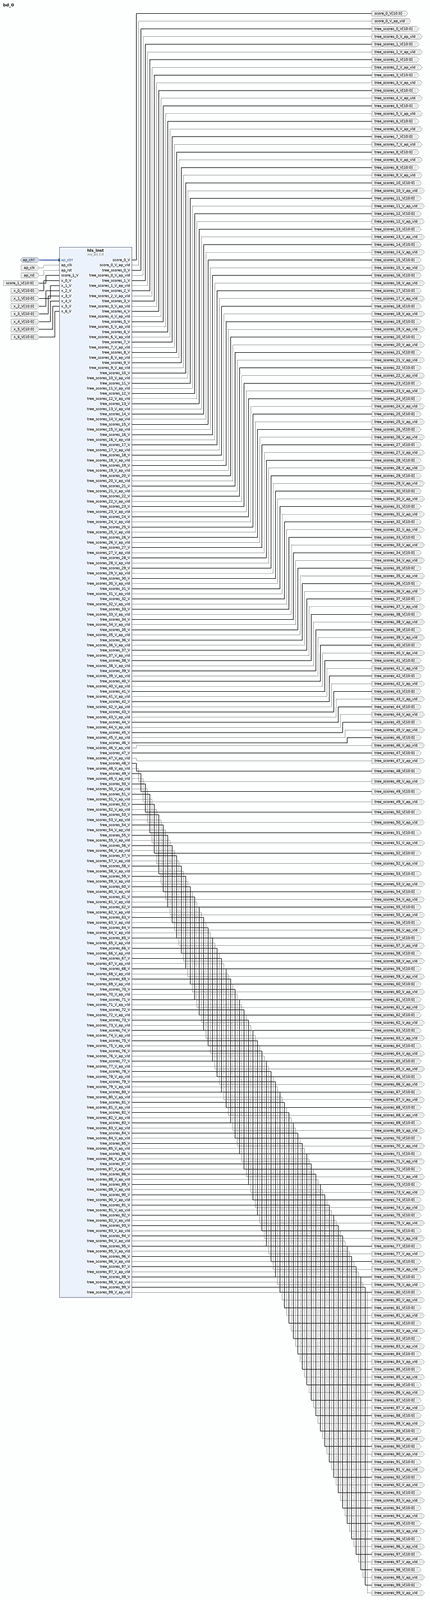
[diagram p0: block diagram of the top level, whole]
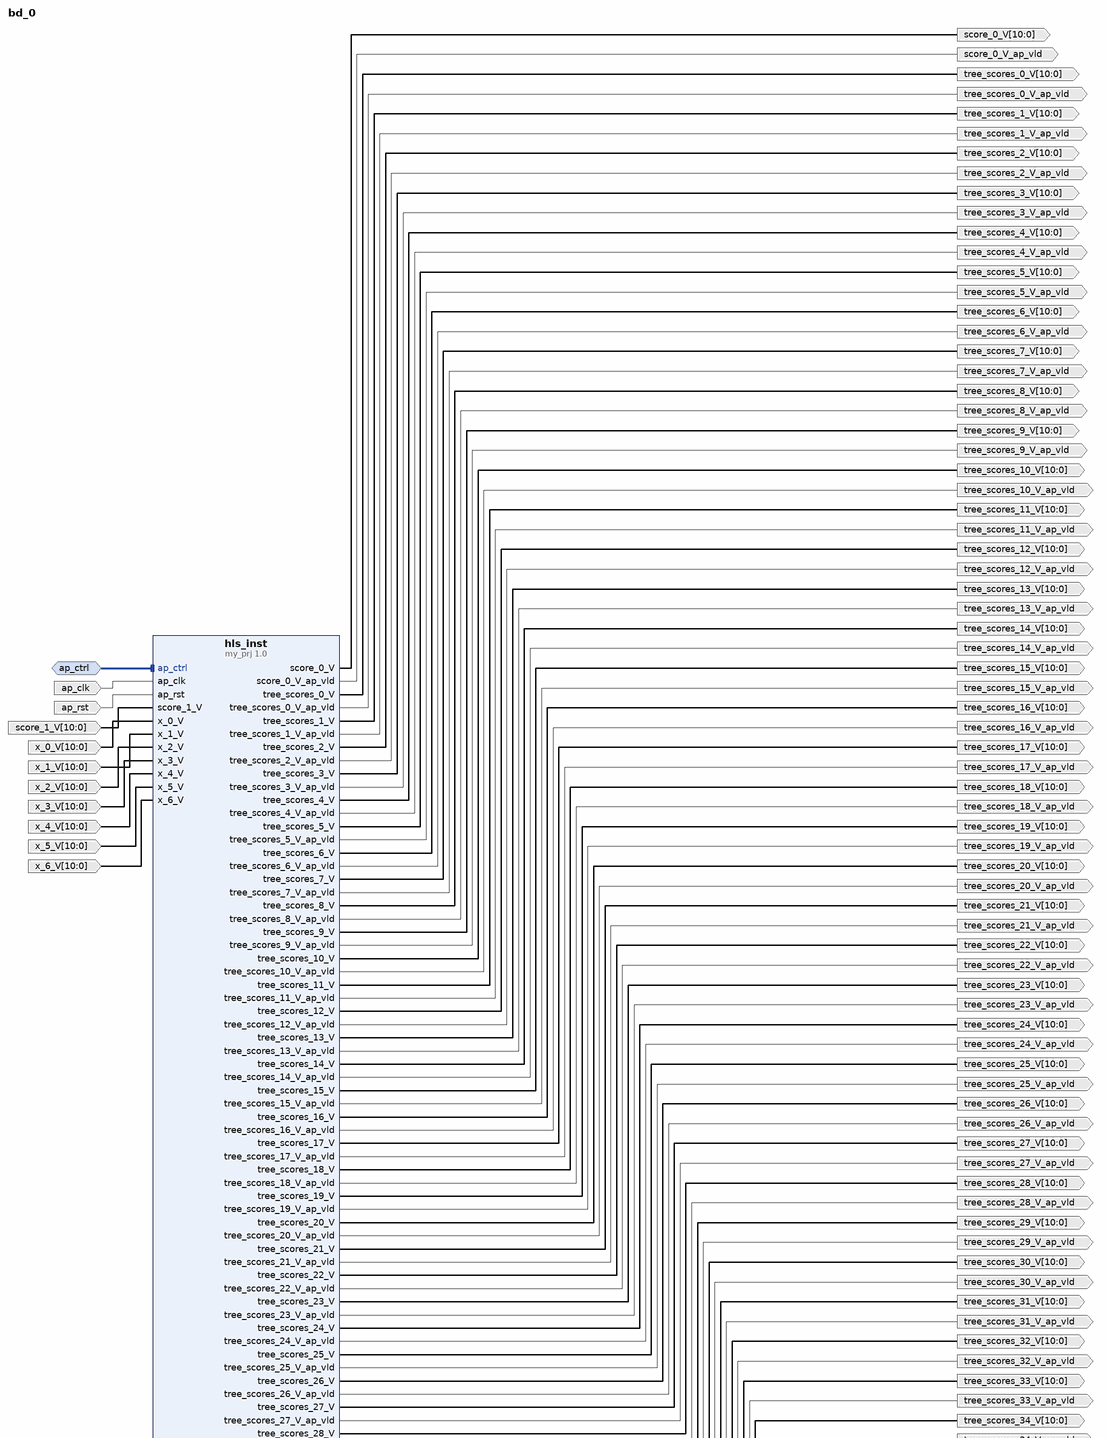
[diagram p1: block diagram of the top level, upper part]
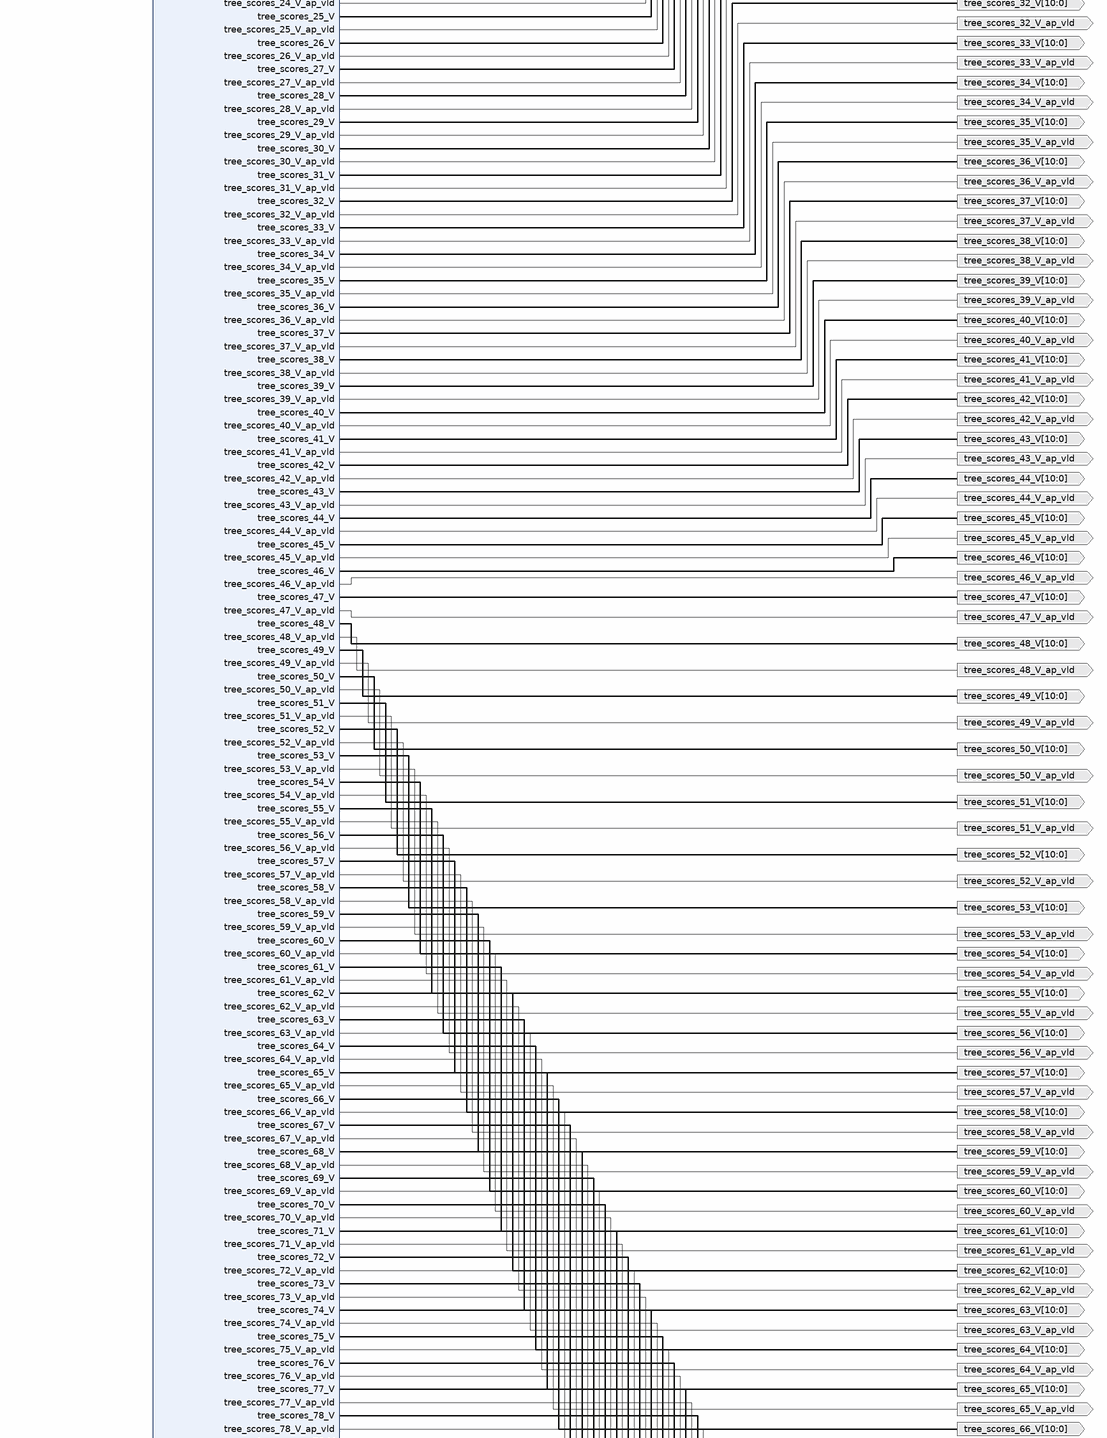
[diagram p2: block diagram of the top level, middle part]
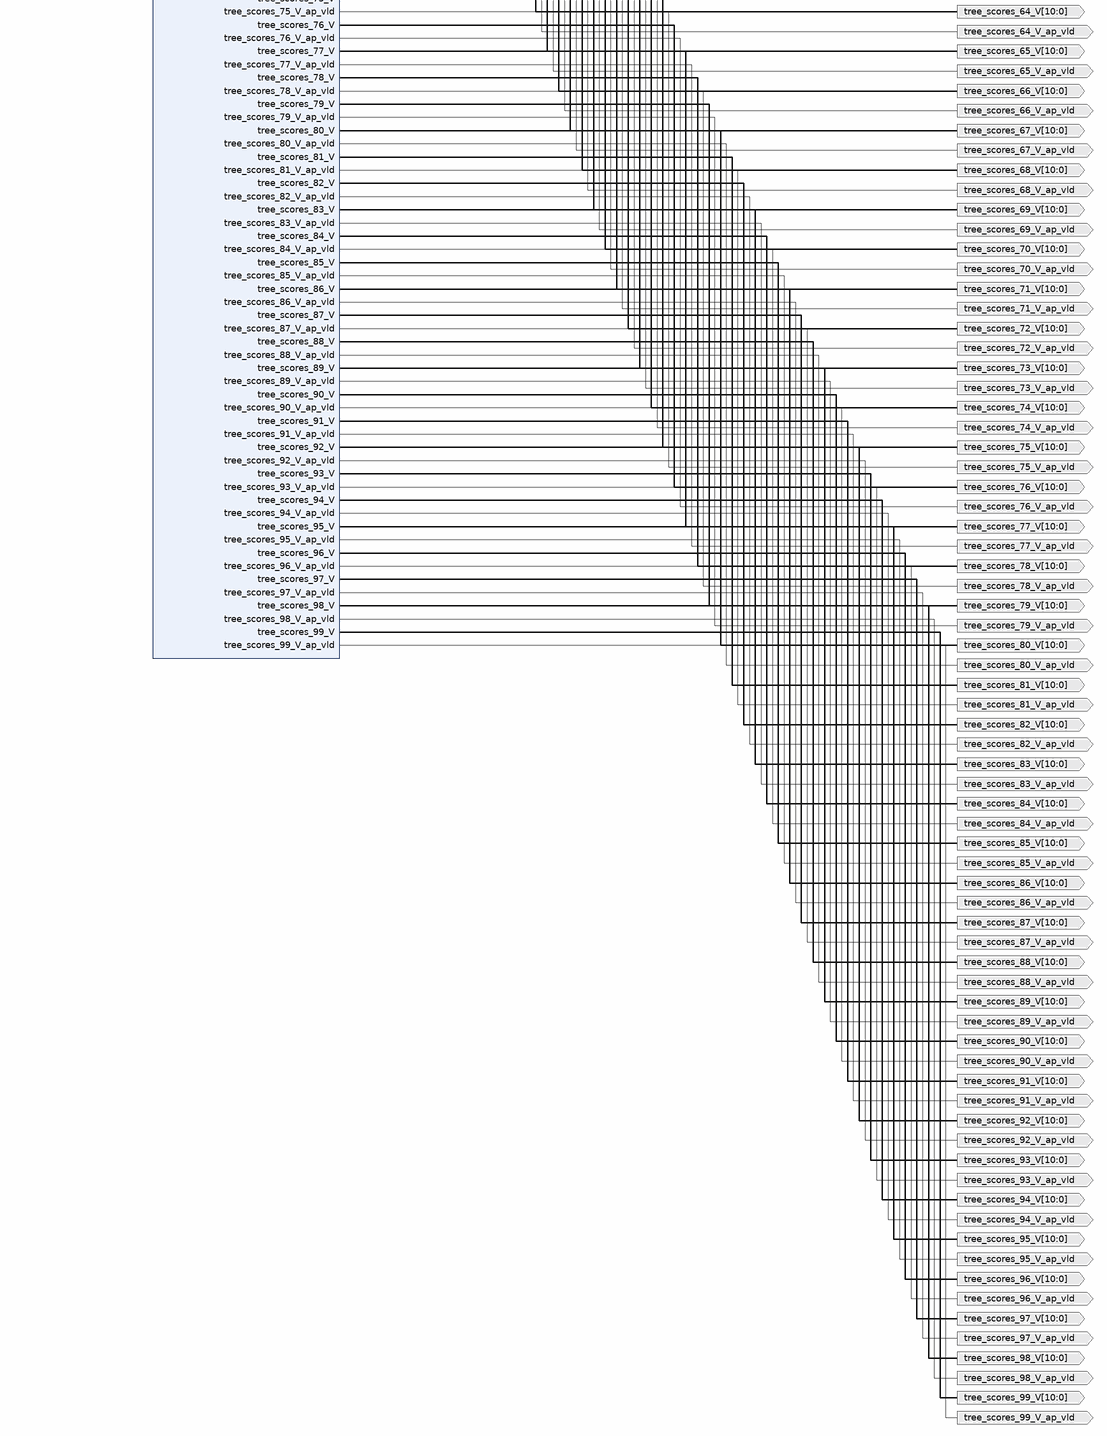
[diagram p3: block diagram of the top level, lower part]
# Vivado block design bd_0, xcvu9p-flgc2104-1-e, Vivado 2019.1
create_bd_design bd_0

create_bd_intf_port -mode Slave -vlnv xilinx.com:interface:acc_handshake_rtl:1.0 ap_ctrl
create_bd_port -dir I -type clk ap_clk
set_property -dict {CONFIG.FREQ_HZ 239000000.0} [get_bd_ports ap_clk]
create_bd_port -dir I -type rst ap_rst
set_property -dict {CONFIG.POLARITY ACTIVE_HIGH} [get_bd_ports ap_rst]
create_bd_port -dir O -from 10 -to 0 -type data score_0_V
create_bd_port -dir O score_0_V_ap_vld
create_bd_port -dir I -from 10 -to 0 -type data score_1_V
create_bd_port -dir O -from 10 -to 0 -type data tree_scores_0_V
create_bd_port -dir O tree_scores_0_V_ap_vld
create_bd_port -dir O -from 10 -to 0 -type data tree_scores_10_V
create_bd_port -dir O tree_scores_10_V_ap_vld
create_bd_port -dir O -from 10 -to 0 -type data tree_scores_11_V
create_bd_port -dir O tree_scores_11_V_ap_vld
create_bd_port -dir O -from 10 -to 0 -type data tree_scores_12_V
create_bd_port -dir O tree_scores_12_V_ap_vld
create_bd_port -dir O -from 10 -to 0 -type data tree_scores_13_V
create_bd_port -dir O tree_scores_13_V_ap_vld
create_bd_port -dir O -from 10 -to 0 -type data tree_scores_14_V
create_bd_port -dir O tree_scores_14_V_ap_vld
create_bd_port -dir O -from 10 -to 0 -type data tree_scores_15_V
create_bd_port -dir O tree_scores_15_V_ap_vld
create_bd_port -dir O -from 10 -to 0 -type data tree_scores_16_V
create_bd_port -dir O tree_scores_16_V_ap_vld
create_bd_port -dir O -from 10 -to 0 -type data tree_scores_17_V
create_bd_port -dir O tree_scores_17_V_ap_vld
create_bd_port -dir O -from 10 -to 0 -type data tree_scores_18_V
create_bd_port -dir O tree_scores_18_V_ap_vld
create_bd_port -dir O -from 10 -to 0 -type data tree_scores_19_V
create_bd_port -dir O tree_scores_19_V_ap_vld
create_bd_port -dir O -from 10 -to 0 -type data tree_scores_1_V
create_bd_port -dir O tree_scores_1_V_ap_vld
create_bd_port -dir O -from 10 -to 0 -type data tree_scores_20_V
create_bd_port -dir O tree_scores_20_V_ap_vld
create_bd_port -dir O -from 10 -to 0 -type data tree_scores_21_V
create_bd_port -dir O tree_scores_21_V_ap_vld
create_bd_port -dir O -from 10 -to 0 -type data tree_scores_22_V
create_bd_port -dir O tree_scores_22_V_ap_vld
create_bd_port -dir O -from 10 -to 0 -type data tree_scores_23_V
create_bd_port -dir O tree_scores_23_V_ap_vld
create_bd_port -dir O -from 10 -to 0 -type data tree_scores_24_V
create_bd_port -dir O tree_scores_24_V_ap_vld
create_bd_port -dir O -from 10 -to 0 -type data tree_scores_25_V
create_bd_port -dir O tree_scores_25_V_ap_vld
create_bd_port -dir O -from 10 -to 0 -type data tree_scores_26_V
create_bd_port -dir O tree_scores_26_V_ap_vld
create_bd_port -dir O -from 10 -to 0 -type data tree_scores_27_V
create_bd_port -dir O tree_scores_27_V_ap_vld
create_bd_port -dir O -from 10 -to 0 -type data tree_scores_28_V
create_bd_port -dir O tree_scores_28_V_ap_vld
create_bd_port -dir O -from 10 -to 0 -type data tree_scores_29_V
create_bd_port -dir O tree_scores_29_V_ap_vld
create_bd_port -dir O -from 10 -to 0 -type data tree_scores_2_V
create_bd_port -dir O tree_scores_2_V_ap_vld
create_bd_port -dir O -from 10 -to 0 -type data tree_scores_30_V
create_bd_port -dir O tree_scores_30_V_ap_vld
create_bd_port -dir O -from 10 -to 0 -type data tree_scores_31_V
create_bd_port -dir O tree_scores_31_V_ap_vld
create_bd_port -dir O -from 10 -to 0 -type data tree_scores_32_V
create_bd_port -dir O tree_scores_32_V_ap_vld
create_bd_port -dir O -from 10 -to 0 -type data tree_scores_33_V
create_bd_port -dir O tree_scores_33_V_ap_vld
create_bd_port -dir O -from 10 -to 0 -type data tree_scores_34_V
create_bd_port -dir O tree_scores_34_V_ap_vld
create_bd_port -dir O -from 10 -to 0 -type data tree_scores_35_V
create_bd_port -dir O tree_scores_35_V_ap_vld
create_bd_port -dir O -from 10 -to 0 -type data tree_scores_36_V
create_bd_port -dir O tree_scores_36_V_ap_vld
create_bd_port -dir O -from 10 -to 0 -type data tree_scores_37_V
create_bd_port -dir O tree_scores_37_V_ap_vld
create_bd_port -dir O -from 10 -to 0 -type data tree_scores_38_V
create_bd_port -dir O tree_scores_38_V_ap_vld
create_bd_port -dir O -from 10 -to 0 -type data tree_scores_39_V
create_bd_port -dir O tree_scores_39_V_ap_vld
create_bd_port -dir O -from 10 -to 0 -type data tree_scores_3_V
create_bd_port -dir O tree_scores_3_V_ap_vld
create_bd_port -dir O -from 10 -to 0 -type data tree_scores_40_V
create_bd_port -dir O tree_scores_40_V_ap_vld
create_bd_port -dir O -from 10 -to 0 -type data tree_scores_41_V
create_bd_port -dir O tree_scores_41_V_ap_vld
create_bd_port -dir O -from 10 -to 0 -type data tree_scores_42_V
create_bd_port -dir O tree_scores_42_V_ap_vld
create_bd_port -dir O -from 10 -to 0 -type data tree_scores_43_V
create_bd_port -dir O tree_scores_43_V_ap_vld
create_bd_port -dir O -from 10 -to 0 -type data tree_scores_44_V
create_bd_port -dir O tree_scores_44_V_ap_vld
create_bd_port -dir O -from 10 -to 0 -type data tree_scores_45_V
create_bd_port -dir O tree_scores_45_V_ap_vld
create_bd_port -dir O -from 10 -to 0 -type data tree_scores_46_V
create_bd_port -dir O tree_scores_46_V_ap_vld
create_bd_port -dir O -from 10 -to 0 -type data tree_scores_47_V
create_bd_port -dir O tree_scores_47_V_ap_vld
create_bd_port -dir O -from 10 -to 0 -type data tree_scores_48_V
create_bd_port -dir O tree_scores_48_V_ap_vld
create_bd_port -dir O -from 10 -to 0 -type data tree_scores_49_V
create_bd_port -dir O tree_scores_49_V_ap_vld
create_bd_port -dir O -from 10 -to 0 -type data tree_scores_4_V
create_bd_port -dir O tree_scores_4_V_ap_vld
create_bd_port -dir O -from 10 -to 0 -type data tree_scores_50_V
create_bd_port -dir O tree_scores_50_V_ap_vld
create_bd_port -dir O -from 10 -to 0 -type data tree_scores_51_V
create_bd_port -dir O tree_scores_51_V_ap_vld
create_bd_port -dir O -from 10 -to 0 -type data tree_scores_52_V
create_bd_port -dir O tree_scores_52_V_ap_vld
create_bd_port -dir O -from 10 -to 0 -type data tree_scores_53_V
create_bd_port -dir O tree_scores_53_V_ap_vld
create_bd_port -dir O -from 10 -to 0 -type data tree_scores_54_V
create_bd_port -dir O tree_scores_54_V_ap_vld
create_bd_port -dir O -from 10 -to 0 -type data tree_scores_55_V
create_bd_port -dir O tree_scores_55_V_ap_vld
create_bd_port -dir O -from 10 -to 0 -type data tree_scores_56_V
create_bd_port -dir O tree_scores_56_V_ap_vld
create_bd_port -dir O -from 10 -to 0 -type data tree_scores_57_V
create_bd_port -dir O tree_scores_57_V_ap_vld
create_bd_port -dir O -from 10 -to 0 -type data tree_scores_58_V
create_bd_port -dir O tree_scores_58_V_ap_vld
create_bd_port -dir O -from 10 -to 0 -type data tree_scores_59_V
create_bd_port -dir O tree_scores_59_V_ap_vld
create_bd_port -dir O -from 10 -to 0 -type data tree_scores_5_V
create_bd_port -dir O tree_scores_5_V_ap_vld
create_bd_port -dir O -from 10 -to 0 -type data tree_scores_60_V
create_bd_port -dir O tree_scores_60_V_ap_vld
create_bd_port -dir O -from 10 -to 0 -type data tree_scores_61_V
create_bd_port -dir O tree_scores_61_V_ap_vld
create_bd_port -dir O -from 10 -to 0 -type data tree_scores_62_V
create_bd_port -dir O tree_scores_62_V_ap_vld
create_bd_port -dir O -from 10 -to 0 -type data tree_scores_63_V
create_bd_port -dir O tree_scores_63_V_ap_vld
create_bd_port -dir O -from 10 -to 0 -type data tree_scores_64_V
create_bd_port -dir O tree_scores_64_V_ap_vld
create_bd_port -dir O -from 10 -to 0 -type data tree_scores_65_V
create_bd_port -dir O tree_scores_65_V_ap_vld
create_bd_port -dir O -from 10 -to 0 -type data tree_scores_66_V
create_bd_port -dir O tree_scores_66_V_ap_vld
create_bd_port -dir O -from 10 -to 0 -type data tree_scores_67_V
create_bd_port -dir O tree_scores_67_V_ap_vld
create_bd_port -dir O -from 10 -to 0 -type data tree_scores_68_V
create_bd_port -dir O tree_scores_68_V_ap_vld
create_bd_port -dir O -from 10 -to 0 -type data tree_scores_69_V
create_bd_port -dir O tree_scores_69_V_ap_vld
create_bd_port -dir O -from 10 -to 0 -type data tree_scores_6_V
create_bd_port -dir O tree_scores_6_V_ap_vld
create_bd_port -dir O -from 10 -to 0 -type data tree_scores_70_V
create_bd_port -dir O tree_scores_70_V_ap_vld
create_bd_port -dir O -from 10 -to 0 -type data tree_scores_71_V
create_bd_port -dir O tree_scores_71_V_ap_vld
create_bd_port -dir O -from 10 -to 0 -type data tree_scores_72_V
create_bd_port -dir O tree_scores_72_V_ap_vld
create_bd_port -dir O -from 10 -to 0 -type data tree_scores_73_V
create_bd_port -dir O tree_scores_73_V_ap_vld
create_bd_port -dir O -from 10 -to 0 -type data tree_scores_74_V
create_bd_port -dir O tree_scores_74_V_ap_vld
create_bd_port -dir O -from 10 -to 0 -type data tree_scores_75_V
create_bd_port -dir O tree_scores_75_V_ap_vld
create_bd_port -dir O -from 10 -to 0 -type data tree_scores_76_V
create_bd_port -dir O tree_scores_76_V_ap_vld
create_bd_port -dir O -from 10 -to 0 -type data tree_scores_77_V
create_bd_port -dir O tree_scores_77_V_ap_vld
create_bd_port -dir O -from 10 -to 0 -type data tree_scores_78_V
create_bd_port -dir O tree_scores_78_V_ap_vld
create_bd_port -dir O -from 10 -to 0 -type data tree_scores_79_V
create_bd_port -dir O tree_scores_79_V_ap_vld
create_bd_port -dir O -from 10 -to 0 -type data tree_scores_7_V
create_bd_port -dir O tree_scores_7_V_ap_vld
create_bd_port -dir O -from 10 -to 0 -type data tree_scores_80_V
create_bd_port -dir O tree_scores_80_V_ap_vld
create_bd_port -dir O -from 10 -to 0 -type data tree_scores_81_V
create_bd_port -dir O tree_scores_81_V_ap_vld
create_bd_port -dir O -from 10 -to 0 -type data tree_scores_82_V
create_bd_port -dir O tree_scores_82_V_ap_vld
create_bd_port -dir O -from 10 -to 0 -type data tree_scores_83_V
create_bd_port -dir O tree_scores_83_V_ap_vld
create_bd_port -dir O -from 10 -to 0 -type data tree_scores_84_V
create_bd_port -dir O tree_scores_84_V_ap_vld
create_bd_port -dir O -from 10 -to 0 -type data tree_scores_85_V
create_bd_port -dir O tree_scores_85_V_ap_vld
create_bd_port -dir O -from 10 -to 0 -type data tree_scores_86_V
create_bd_port -dir O tree_scores_86_V_ap_vld
create_bd_port -dir O -from 10 -to 0 -type data tree_scores_87_V
create_bd_port -dir O tree_scores_87_V_ap_vld
create_bd_port -dir O -from 10 -to 0 -type data tree_scores_88_V
create_bd_port -dir O tree_scores_88_V_ap_vld
create_bd_port -dir O -from 10 -to 0 -type data tree_scores_89_V
create_bd_port -dir O tree_scores_89_V_ap_vld
create_bd_port -dir O -from 10 -to 0 -type data tree_scores_8_V
create_bd_port -dir O tree_scores_8_V_ap_vld
create_bd_port -dir O -from 10 -to 0 -type data tree_scores_90_V
create_bd_port -dir O tree_scores_90_V_ap_vld
create_bd_port -dir O -from 10 -to 0 -type data tree_scores_91_V
create_bd_port -dir O tree_scores_91_V_ap_vld
create_bd_port -dir O -from 10 -to 0 -type data tree_scores_92_V
create_bd_port -dir O tree_scores_92_V_ap_vld
create_bd_port -dir O -from 10 -to 0 -type data tree_scores_93_V
create_bd_port -dir O tree_scores_93_V_ap_vld
create_bd_port -dir O -from 10 -to 0 -type data tree_scores_94_V
create_bd_port -dir O tree_scores_94_V_ap_vld
create_bd_port -dir O -from 10 -to 0 -type data tree_scores_95_V
create_bd_port -dir O tree_scores_95_V_ap_vld
create_bd_port -dir O -from 10 -to 0 -type data tree_scores_96_V
create_bd_port -dir O tree_scores_96_V_ap_vld
create_bd_port -dir O -from 10 -to 0 -type data tree_scores_97_V
create_bd_port -dir O tree_scores_97_V_ap_vld
create_bd_port -dir O -from 10 -to 0 -type data tree_scores_98_V
create_bd_port -dir O tree_scores_98_V_ap_vld
create_bd_port -dir O -from 10 -to 0 -type data tree_scores_99_V
create_bd_port -dir O tree_scores_99_V_ap_vld
create_bd_port -dir O -from 10 -to 0 -type data tree_scores_9_V
create_bd_port -dir O tree_scores_9_V_ap_vld
create_bd_port -dir I -from 10 -to 0 -type data x_0_V
create_bd_port -dir I -from 10 -to 0 -type data x_1_V
create_bd_port -dir I -from 10 -to 0 -type data x_2_V
create_bd_port -dir I -from 10 -to 0 -type data x_3_V
create_bd_port -dir I -from 10 -to 0 -type data x_4_V
create_bd_port -dir I -from 10 -to 0 -type data x_5_V
create_bd_port -dir I -from 10 -to 0 -type data x_6_V

create_bd_cell -type ip -vlnv xilinx.com:hls:my_prj:1.0 hls_inst

# ---- connections ----

connect_bd_intf_net -intf_net ap_ctrl_0_1 [get_bd_intf_ports ap_ctrl] [get_bd_intf_pins hls_inst/ap_ctrl]
connect_bd_net -net ap_clk_0_1 [get_bd_ports ap_clk] [get_bd_pins hls_inst/ap_clk]
connect_bd_net -net ap_rst_0_1 [get_bd_ports ap_rst] [get_bd_pins hls_inst/ap_rst]
connect_bd_net [get_bd_pins hls_inst/score_0_V] [get_bd_ports score_0_V]
connect_bd_net [get_bd_pins hls_inst/score_0_V_ap_vld] [get_bd_ports score_0_V_ap_vld]
connect_bd_net -net score_1_V_0_1 [get_bd_ports score_1_V] [get_bd_pins hls_inst/score_1_V]
connect_bd_net [get_bd_pins hls_inst/tree_scores_0_V] [get_bd_ports tree_scores_0_V]
connect_bd_net [get_bd_pins hls_inst/tree_scores_0_V_ap_vld] [get_bd_ports tree_scores_0_V_ap_vld]
connect_bd_net [get_bd_pins hls_inst/tree_scores_10_V] [get_bd_ports tree_scores_10_V]
connect_bd_net [get_bd_pins hls_inst/tree_scores_10_V_ap_vld] [get_bd_ports tree_scores_10_V_ap_vld]
connect_bd_net [get_bd_pins hls_inst/tree_scores_11_V] [get_bd_ports tree_scores_11_V]
connect_bd_net [get_bd_pins hls_inst/tree_scores_11_V_ap_vld] [get_bd_ports tree_scores_11_V_ap_vld]
connect_bd_net [get_bd_pins hls_inst/tree_scores_12_V] [get_bd_ports tree_scores_12_V]
connect_bd_net [get_bd_pins hls_inst/tree_scores_12_V_ap_vld] [get_bd_ports tree_scores_12_V_ap_vld]
connect_bd_net [get_bd_pins hls_inst/tree_scores_13_V] [get_bd_ports tree_scores_13_V]
connect_bd_net [get_bd_pins hls_inst/tree_scores_13_V_ap_vld] [get_bd_ports tree_scores_13_V_ap_vld]
connect_bd_net [get_bd_pins hls_inst/tree_scores_14_V] [get_bd_ports tree_scores_14_V]
connect_bd_net [get_bd_pins hls_inst/tree_scores_14_V_ap_vld] [get_bd_ports tree_scores_14_V_ap_vld]
connect_bd_net [get_bd_pins hls_inst/tree_scores_15_V] [get_bd_ports tree_scores_15_V]
connect_bd_net [get_bd_pins hls_inst/tree_scores_15_V_ap_vld] [get_bd_ports tree_scores_15_V_ap_vld]
connect_bd_net [get_bd_pins hls_inst/tree_scores_16_V] [get_bd_ports tree_scores_16_V]
connect_bd_net [get_bd_pins hls_inst/tree_scores_16_V_ap_vld] [get_bd_ports tree_scores_16_V_ap_vld]
connect_bd_net [get_bd_pins hls_inst/tree_scores_17_V] [get_bd_ports tree_scores_17_V]
connect_bd_net [get_bd_pins hls_inst/tree_scores_17_V_ap_vld] [get_bd_ports tree_scores_17_V_ap_vld]
connect_bd_net [get_bd_pins hls_inst/tree_scores_18_V] [get_bd_ports tree_scores_18_V]
connect_bd_net [get_bd_pins hls_inst/tree_scores_18_V_ap_vld] [get_bd_ports tree_scores_18_V_ap_vld]
connect_bd_net [get_bd_pins hls_inst/tree_scores_19_V] [get_bd_ports tree_scores_19_V]
connect_bd_net [get_bd_pins hls_inst/tree_scores_19_V_ap_vld] [get_bd_ports tree_scores_19_V_ap_vld]
connect_bd_net [get_bd_pins hls_inst/tree_scores_1_V] [get_bd_ports tree_scores_1_V]
connect_bd_net [get_bd_pins hls_inst/tree_scores_1_V_ap_vld] [get_bd_ports tree_scores_1_V_ap_vld]
connect_bd_net [get_bd_pins hls_inst/tree_scores_20_V] [get_bd_ports tree_scores_20_V]
connect_bd_net [get_bd_pins hls_inst/tree_scores_20_V_ap_vld] [get_bd_ports tree_scores_20_V_ap_vld]
connect_bd_net [get_bd_pins hls_inst/tree_scores_21_V] [get_bd_ports tree_scores_21_V]
connect_bd_net [get_bd_pins hls_inst/tree_scores_21_V_ap_vld] [get_bd_ports tree_scores_21_V_ap_vld]
connect_bd_net [get_bd_pins hls_inst/tree_scores_22_V] [get_bd_ports tree_scores_22_V]
connect_bd_net [get_bd_pins hls_inst/tree_scores_22_V_ap_vld] [get_bd_ports tree_scores_22_V_ap_vld]
connect_bd_net [get_bd_pins hls_inst/tree_scores_23_V] [get_bd_ports tree_scores_23_V]
connect_bd_net [get_bd_pins hls_inst/tree_scores_23_V_ap_vld] [get_bd_ports tree_scores_23_V_ap_vld]
connect_bd_net [get_bd_pins hls_inst/tree_scores_24_V] [get_bd_ports tree_scores_24_V]
connect_bd_net [get_bd_pins hls_inst/tree_scores_24_V_ap_vld] [get_bd_ports tree_scores_24_V_ap_vld]
connect_bd_net [get_bd_pins hls_inst/tree_scores_25_V] [get_bd_ports tree_scores_25_V]
connect_bd_net [get_bd_pins hls_inst/tree_scores_25_V_ap_vld] [get_bd_ports tree_scores_25_V_ap_vld]
connect_bd_net [get_bd_pins hls_inst/tree_scores_26_V] [get_bd_ports tree_scores_26_V]
connect_bd_net [get_bd_pins hls_inst/tree_scores_26_V_ap_vld] [get_bd_ports tree_scores_26_V_ap_vld]
connect_bd_net [get_bd_pins hls_inst/tree_scores_27_V] [get_bd_ports tree_scores_27_V]
connect_bd_net [get_bd_pins hls_inst/tree_scores_27_V_ap_vld] [get_bd_ports tree_scores_27_V_ap_vld]
connect_bd_net [get_bd_pins hls_inst/tree_scores_28_V] [get_bd_ports tree_scores_28_V]
connect_bd_net [get_bd_pins hls_inst/tree_scores_28_V_ap_vld] [get_bd_ports tree_scores_28_V_ap_vld]
connect_bd_net [get_bd_pins hls_inst/tree_scores_29_V] [get_bd_ports tree_scores_29_V]
connect_bd_net [get_bd_pins hls_inst/tree_scores_29_V_ap_vld] [get_bd_ports tree_scores_29_V_ap_vld]
connect_bd_net [get_bd_pins hls_inst/tree_scores_2_V] [get_bd_ports tree_scores_2_V]
connect_bd_net [get_bd_pins hls_inst/tree_scores_2_V_ap_vld] [get_bd_ports tree_scores_2_V_ap_vld]
connect_bd_net [get_bd_pins hls_inst/tree_scores_30_V] [get_bd_ports tree_scores_30_V]
connect_bd_net [get_bd_pins hls_inst/tree_scores_30_V_ap_vld] [get_bd_ports tree_scores_30_V_ap_vld]
connect_bd_net [get_bd_pins hls_inst/tree_scores_31_V] [get_bd_ports tree_scores_31_V]
connect_bd_net [get_bd_pins hls_inst/tree_scores_31_V_ap_vld] [get_bd_ports tree_scores_31_V_ap_vld]
connect_bd_net [get_bd_pins hls_inst/tree_scores_32_V] [get_bd_ports tree_scores_32_V]
connect_bd_net [get_bd_pins hls_inst/tree_scores_32_V_ap_vld] [get_bd_ports tree_scores_32_V_ap_vld]
connect_bd_net [get_bd_pins hls_inst/tree_scores_33_V] [get_bd_ports tree_scores_33_V]
connect_bd_net [get_bd_pins hls_inst/tree_scores_33_V_ap_vld] [get_bd_ports tree_scores_33_V_ap_vld]
connect_bd_net [get_bd_pins hls_inst/tree_scores_34_V] [get_bd_ports tree_scores_34_V]
connect_bd_net [get_bd_pins hls_inst/tree_scores_34_V_ap_vld] [get_bd_ports tree_scores_34_V_ap_vld]
connect_bd_net [get_bd_pins hls_inst/tree_scores_35_V] [get_bd_ports tree_scores_35_V]
connect_bd_net [get_bd_pins hls_inst/tree_scores_35_V_ap_vld] [get_bd_ports tree_scores_35_V_ap_vld]
connect_bd_net [get_bd_pins hls_inst/tree_scores_36_V] [get_bd_ports tree_scores_36_V]
connect_bd_net [get_bd_pins hls_inst/tree_scores_36_V_ap_vld] [get_bd_ports tree_scores_36_V_ap_vld]
connect_bd_net [get_bd_pins hls_inst/tree_scores_37_V] [get_bd_ports tree_scores_37_V]
connect_bd_net [get_bd_pins hls_inst/tree_scores_37_V_ap_vld] [get_bd_ports tree_scores_37_V_ap_vld]
connect_bd_net [get_bd_pins hls_inst/tree_scores_38_V] [get_bd_ports tree_scores_38_V]
connect_bd_net [get_bd_pins hls_inst/tree_scores_38_V_ap_vld] [get_bd_ports tree_scores_38_V_ap_vld]
connect_bd_net [get_bd_pins hls_inst/tree_scores_39_V] [get_bd_ports tree_scores_39_V]
connect_bd_net [get_bd_pins hls_inst/tree_scores_39_V_ap_vld] [get_bd_ports tree_scores_39_V_ap_vld]
connect_bd_net [get_bd_pins hls_inst/tree_scores_3_V] [get_bd_ports tree_scores_3_V]
connect_bd_net [get_bd_pins hls_inst/tree_scores_3_V_ap_vld] [get_bd_ports tree_scores_3_V_ap_vld]
connect_bd_net [get_bd_pins hls_inst/tree_scores_40_V] [get_bd_ports tree_scores_40_V]
connect_bd_net [get_bd_pins hls_inst/tree_scores_40_V_ap_vld] [get_bd_ports tree_scores_40_V_ap_vld]
connect_bd_net [get_bd_pins hls_inst/tree_scores_41_V] [get_bd_ports tree_scores_41_V]
connect_bd_net [get_bd_pins hls_inst/tree_scores_41_V_ap_vld] [get_bd_ports tree_scores_41_V_ap_vld]
connect_bd_net [get_bd_pins hls_inst/tree_scores_42_V] [get_bd_ports tree_scores_42_V]
connect_bd_net [get_bd_pins hls_inst/tree_scores_42_V_ap_vld] [get_bd_ports tree_scores_42_V_ap_vld]
connect_bd_net [get_bd_pins hls_inst/tree_scores_43_V] [get_bd_ports tree_scores_43_V]
connect_bd_net [get_bd_pins hls_inst/tree_scores_43_V_ap_vld] [get_bd_ports tree_scores_43_V_ap_vld]
connect_bd_net [get_bd_pins hls_inst/tree_scores_44_V] [get_bd_ports tree_scores_44_V]
connect_bd_net [get_bd_pins hls_inst/tree_scores_44_V_ap_vld] [get_bd_ports tree_scores_44_V_ap_vld]
connect_bd_net [get_bd_pins hls_inst/tree_scores_45_V] [get_bd_ports tree_scores_45_V]
connect_bd_net [get_bd_pins hls_inst/tree_scores_45_V_ap_vld] [get_bd_ports tree_scores_45_V_ap_vld]
connect_bd_net [get_bd_pins hls_inst/tree_scores_46_V] [get_bd_ports tree_scores_46_V]
connect_bd_net [get_bd_pins hls_inst/tree_scores_46_V_ap_vld] [get_bd_ports tree_scores_46_V_ap_vld]
connect_bd_net [get_bd_pins hls_inst/tree_scores_47_V] [get_bd_ports tree_scores_47_V]
connect_bd_net [get_bd_pins hls_inst/tree_scores_47_V_ap_vld] [get_bd_ports tree_scores_47_V_ap_vld]
connect_bd_net [get_bd_pins hls_inst/tree_scores_48_V] [get_bd_ports tree_scores_48_V]
connect_bd_net [get_bd_pins hls_inst/tree_scores_48_V_ap_vld] [get_bd_ports tree_scores_48_V_ap_vld]
connect_bd_net [get_bd_pins hls_inst/tree_scores_49_V] [get_bd_ports tree_scores_49_V]
connect_bd_net [get_bd_pins hls_inst/tree_scores_49_V_ap_vld] [get_bd_ports tree_scores_49_V_ap_vld]
connect_bd_net [get_bd_pins hls_inst/tree_scores_4_V] [get_bd_ports tree_scores_4_V]
connect_bd_net [get_bd_pins hls_inst/tree_scores_4_V_ap_vld] [get_bd_ports tree_scores_4_V_ap_vld]
connect_bd_net [get_bd_pins hls_inst/tree_scores_50_V] [get_bd_ports tree_scores_50_V]
connect_bd_net [get_bd_pins hls_inst/tree_scores_50_V_ap_vld] [get_bd_ports tree_scores_50_V_ap_vld]
connect_bd_net [get_bd_pins hls_inst/tree_scores_51_V] [get_bd_ports tree_scores_51_V]
connect_bd_net [get_bd_pins hls_inst/tree_scores_51_V_ap_vld] [get_bd_ports tree_scores_51_V_ap_vld]
connect_bd_net [get_bd_pins hls_inst/tree_scores_52_V] [get_bd_ports tree_scores_52_V]
connect_bd_net [get_bd_pins hls_inst/tree_scores_52_V_ap_vld] [get_bd_ports tree_scores_52_V_ap_vld]
connect_bd_net [get_bd_pins hls_inst/tree_scores_53_V] [get_bd_ports tree_scores_53_V]
connect_bd_net [get_bd_pins hls_inst/tree_scores_53_V_ap_vld] [get_bd_ports tree_scores_53_V_ap_vld]
connect_bd_net [get_bd_pins hls_inst/tree_scores_54_V] [get_bd_ports tree_scores_54_V]
connect_bd_net [get_bd_pins hls_inst/tree_scores_54_V_ap_vld] [get_bd_ports tree_scores_54_V_ap_vld]
connect_bd_net [get_bd_pins hls_inst/tree_scores_55_V] [get_bd_ports tree_scores_55_V]
connect_bd_net [get_bd_pins hls_inst/tree_scores_55_V_ap_vld] [get_bd_ports tree_scores_55_V_ap_vld]
connect_bd_net [get_bd_pins hls_inst/tree_scores_56_V] [get_bd_ports tree_scores_56_V]
connect_bd_net [get_bd_pins hls_inst/tree_scores_56_V_ap_vld] [get_bd_ports tree_scores_56_V_ap_vld]
connect_bd_net [get_bd_pins hls_inst/tree_scores_57_V] [get_bd_ports tree_scores_57_V]
connect_bd_net [get_bd_pins hls_inst/tree_scores_57_V_ap_vld] [get_bd_ports tree_scores_57_V_ap_vld]
connect_bd_net [get_bd_pins hls_inst/tree_scores_58_V] [get_bd_ports tree_scores_58_V]
connect_bd_net [get_bd_pins hls_inst/tree_scores_58_V_ap_vld] [get_bd_ports tree_scores_58_V_ap_vld]
connect_bd_net [get_bd_pins hls_inst/tree_scores_59_V] [get_bd_ports tree_scores_59_V]
connect_bd_net [get_bd_pins hls_inst/tree_scores_59_V_ap_vld] [get_bd_ports tree_scores_59_V_ap_vld]
connect_bd_net [get_bd_pins hls_inst/tree_scores_5_V] [get_bd_ports tree_scores_5_V]
connect_bd_net [get_bd_pins hls_inst/tree_scores_5_V_ap_vld] [get_bd_ports tree_scores_5_V_ap_vld]
connect_bd_net [get_bd_pins hls_inst/tree_scores_60_V] [get_bd_ports tree_scores_60_V]
connect_bd_net [get_bd_pins hls_inst/tree_scores_60_V_ap_vld] [get_bd_ports tree_scores_60_V_ap_vld]
connect_bd_net [get_bd_pins hls_inst/tree_scores_61_V] [get_bd_ports tree_scores_61_V]
connect_bd_net [get_bd_pins hls_inst/tree_scores_61_V_ap_vld] [get_bd_ports tree_scores_61_V_ap_vld]
connect_bd_net [get_bd_pins hls_inst/tree_scores_62_V] [get_bd_ports tree_scores_62_V]
connect_bd_net [get_bd_pins hls_inst/tree_scores_62_V_ap_vld] [get_bd_ports tree_scores_62_V_ap_vld]
connect_bd_net [get_bd_pins hls_inst/tree_scores_63_V] [get_bd_ports tree_scores_63_V]
connect_bd_net [get_bd_pins hls_inst/tree_scores_63_V_ap_vld] [get_bd_ports tree_scores_63_V_ap_vld]
connect_bd_net [get_bd_pins hls_inst/tree_scores_64_V] [get_bd_ports tree_scores_64_V]
connect_bd_net [get_bd_pins hls_inst/tree_scores_64_V_ap_vld] [get_bd_ports tree_scores_64_V_ap_vld]
connect_bd_net [get_bd_pins hls_inst/tree_scores_65_V] [get_bd_ports tree_scores_65_V]
connect_bd_net [get_bd_pins hls_inst/tree_scores_65_V_ap_vld] [get_bd_ports tree_scores_65_V_ap_vld]
connect_bd_net [get_bd_pins hls_inst/tree_scores_66_V] [get_bd_ports tree_scores_66_V]
connect_bd_net [get_bd_pins hls_inst/tree_scores_66_V_ap_vld] [get_bd_ports tree_scores_66_V_ap_vld]
connect_bd_net [get_bd_pins hls_inst/tree_scores_67_V] [get_bd_ports tree_scores_67_V]
connect_bd_net [get_bd_pins hls_inst/tree_scores_67_V_ap_vld] [get_bd_ports tree_scores_67_V_ap_vld]
connect_bd_net [get_bd_pins hls_inst/tree_scores_68_V] [get_bd_ports tree_scores_68_V]
connect_bd_net [get_bd_pins hls_inst/tree_scores_68_V_ap_vld] [get_bd_ports tree_scores_68_V_ap_vld]
connect_bd_net [get_bd_pins hls_inst/tree_scores_69_V] [get_bd_ports tree_scores_69_V]
connect_bd_net [get_bd_pins hls_inst/tree_scores_69_V_ap_vld] [get_bd_ports tree_scores_69_V_ap_vld]
connect_bd_net [get_bd_pins hls_inst/tree_scores_6_V] [get_bd_ports tree_scores_6_V]
connect_bd_net [get_bd_pins hls_inst/tree_scores_6_V_ap_vld] [get_bd_ports tree_scores_6_V_ap_vld]
connect_bd_net [get_bd_pins hls_inst/tree_scores_70_V] [get_bd_ports tree_scores_70_V]
connect_bd_net [get_bd_pins hls_inst/tree_scores_70_V_ap_vld] [get_bd_ports tree_scores_70_V_ap_vld]
connect_bd_net [get_bd_pins hls_inst/tree_scores_71_V] [get_bd_ports tree_scores_71_V]
connect_bd_net [get_bd_pins hls_inst/tree_scores_71_V_ap_vld] [get_bd_ports tree_scores_71_V_ap_vld]
connect_bd_net [get_bd_pins hls_inst/tree_scores_72_V] [get_bd_ports tree_scores_72_V]
connect_bd_net [get_bd_pins hls_inst/tree_scores_72_V_ap_vld] [get_bd_ports tree_scores_72_V_ap_vld]
connect_bd_net [get_bd_pins hls_inst/tree_scores_73_V] [get_bd_ports tree_scores_73_V]
connect_bd_net [get_bd_pins hls_inst/tree_scores_73_V_ap_vld] [get_bd_ports tree_scores_73_V_ap_vld]
connect_bd_net [get_bd_pins hls_inst/tree_scores_74_V] [get_bd_ports tree_scores_74_V]
connect_bd_net [get_bd_pins hls_inst/tree_scores_74_V_ap_vld] [get_bd_ports tree_scores_74_V_ap_vld]
connect_bd_net [get_bd_pins hls_inst/tree_scores_75_V] [get_bd_ports tree_scores_75_V]
connect_bd_net [get_bd_pins hls_inst/tree_scores_75_V_ap_vld] [get_bd_ports tree_scores_75_V_ap_vld]
connect_bd_net [get_bd_pins hls_inst/tree_scores_76_V] [get_bd_ports tree_scores_76_V]
connect_bd_net [get_bd_pins hls_inst/tree_scores_76_V_ap_vld] [get_bd_ports tree_scores_76_V_ap_vld]
connect_bd_net [get_bd_pins hls_inst/tree_scores_77_V] [get_bd_ports tree_scores_77_V]
connect_bd_net [get_bd_pins hls_inst/tree_scores_77_V_ap_vld] [get_bd_ports tree_scores_77_V_ap_vld]
connect_bd_net [get_bd_pins hls_inst/tree_scores_78_V] [get_bd_ports tree_scores_78_V]
connect_bd_net [get_bd_pins hls_inst/tree_scores_78_V_ap_vld] [get_bd_ports tree_scores_78_V_ap_vld]
connect_bd_net [get_bd_pins hls_inst/tree_scores_79_V] [get_bd_ports tree_scores_79_V]
connect_bd_net [get_bd_pins hls_inst/tree_scores_79_V_ap_vld] [get_bd_ports tree_scores_79_V_ap_vld]
connect_bd_net [get_bd_pins hls_inst/tree_scores_7_V] [get_bd_ports tree_scores_7_V]
connect_bd_net [get_bd_pins hls_inst/tree_scores_7_V_ap_vld] [get_bd_ports tree_scores_7_V_ap_vld]
connect_bd_net [get_bd_pins hls_inst/tree_scores_80_V] [get_bd_ports tree_scores_80_V]
connect_bd_net [get_bd_pins hls_inst/tree_scores_80_V_ap_vld] [get_bd_ports tree_scores_80_V_ap_vld]
connect_bd_net [get_bd_pins hls_inst/tree_scores_81_V] [get_bd_ports tree_scores_81_V]
connect_bd_net [get_bd_pins hls_inst/tree_scores_81_V_ap_vld] [get_bd_ports tree_scores_81_V_ap_vld]
connect_bd_net [get_bd_pins hls_inst/tree_scores_82_V] [get_bd_ports tree_scores_82_V]
connect_bd_net [get_bd_pins hls_inst/tree_scores_82_V_ap_vld] [get_bd_ports tree_scores_82_V_ap_vld]
connect_bd_net [get_bd_pins hls_inst/tree_scores_83_V] [get_bd_ports tree_scores_83_V]
connect_bd_net [get_bd_pins hls_inst/tree_scores_83_V_ap_vld] [get_bd_ports tree_scores_83_V_ap_vld]
connect_bd_net [get_bd_pins hls_inst/tree_scores_84_V] [get_bd_ports tree_scores_84_V]
connect_bd_net [get_bd_pins hls_inst/tree_scores_84_V_ap_vld] [get_bd_ports tree_scores_84_V_ap_vld]
connect_bd_net [get_bd_pins hls_inst/tree_scores_85_V] [get_bd_ports tree_scores_85_V]
connect_bd_net [get_bd_pins hls_inst/tree_scores_85_V_ap_vld] [get_bd_ports tree_scores_85_V_ap_vld]
connect_bd_net [get_bd_pins hls_inst/tree_scores_86_V] [get_bd_ports tree_scores_86_V]
connect_bd_net [get_bd_pins hls_inst/tree_scores_86_V_ap_vld] [get_bd_ports tree_scores_86_V_ap_vld]
connect_bd_net [get_bd_pins hls_inst/tree_scores_87_V] [get_bd_ports tree_scores_87_V]
connect_bd_net [get_bd_pins hls_inst/tree_scores_87_V_ap_vld] [get_bd_ports tree_scores_87_V_ap_vld]
connect_bd_net [get_bd_pins hls_inst/tree_scores_88_V] [get_bd_ports tree_scores_88_V]
connect_bd_net [get_bd_pins hls_inst/tree_scores_88_V_ap_vld] [get_bd_ports tree_scores_88_V_ap_vld]
connect_bd_net [get_bd_pins hls_inst/tree_scores_89_V] [get_bd_ports tree_scores_89_V]
connect_bd_net [get_bd_pins hls_inst/tree_scores_89_V_ap_vld] [get_bd_ports tree_scores_89_V_ap_vld]
connect_bd_net [get_bd_pins hls_inst/tree_scores_8_V] [get_bd_ports tree_scores_8_V]
connect_bd_net [get_bd_pins hls_inst/tree_scores_8_V_ap_vld] [get_bd_ports tree_scores_8_V_ap_vld]
connect_bd_net [get_bd_pins hls_inst/tree_scores_90_V] [get_bd_ports tree_scores_90_V]
connect_bd_net [get_bd_pins hls_inst/tree_scores_90_V_ap_vld] [get_bd_ports tree_scores_90_V_ap_vld]
connect_bd_net [get_bd_pins hls_inst/tree_scores_91_V] [get_bd_ports tree_scores_91_V]
connect_bd_net [get_bd_pins hls_inst/tree_scores_91_V_ap_vld] [get_bd_ports tree_scores_91_V_ap_vld]
connect_bd_net [get_bd_pins hls_inst/tree_scores_92_V] [get_bd_ports tree_scores_92_V]
connect_bd_net [get_bd_pins hls_inst/tree_scores_92_V_ap_vld] [get_bd_ports tree_scores_92_V_ap_vld]
connect_bd_net [get_bd_pins hls_inst/tree_scores_93_V] [get_bd_ports tree_scores_93_V]
connect_bd_net [get_bd_pins hls_inst/tree_scores_93_V_ap_vld] [get_bd_ports tree_scores_93_V_ap_vld]
connect_bd_net [get_bd_pins hls_inst/tree_scores_94_V] [get_bd_ports tree_scores_94_V]
connect_bd_net [get_bd_pins hls_inst/tree_scores_94_V_ap_vld] [get_bd_ports tree_scores_94_V_ap_vld]
connect_bd_net [get_bd_pins hls_inst/tree_scores_95_V] [get_bd_ports tree_scores_95_V]
connect_bd_net [get_bd_pins hls_inst/tree_scores_95_V_ap_vld] [get_bd_ports tree_scores_95_V_ap_vld]
connect_bd_net [get_bd_pins hls_inst/tree_scores_96_V] [get_bd_ports tree_scores_96_V]
connect_bd_net [get_bd_pins hls_inst/tree_scores_96_V_ap_vld] [get_bd_ports tree_scores_96_V_ap_vld]
connect_bd_net [get_bd_pins hls_inst/tree_scores_97_V] [get_bd_ports tree_scores_97_V]
connect_bd_net [get_bd_pins hls_inst/tree_scores_97_V_ap_vld] [get_bd_ports tree_scores_97_V_ap_vld]
connect_bd_net [get_bd_pins hls_inst/tree_scores_98_V] [get_bd_ports tree_scores_98_V]
connect_bd_net [get_bd_pins hls_inst/tree_scores_98_V_ap_vld] [get_bd_ports tree_scores_98_V_ap_vld]
connect_bd_net [get_bd_pins hls_inst/tree_scores_99_V] [get_bd_ports tree_scores_99_V]
connect_bd_net [get_bd_pins hls_inst/tree_scores_99_V_ap_vld] [get_bd_ports tree_scores_99_V_ap_vld]
connect_bd_net [get_bd_pins hls_inst/tree_scores_9_V] [get_bd_ports tree_scores_9_V]
connect_bd_net [get_bd_pins hls_inst/tree_scores_9_V_ap_vld] [get_bd_ports tree_scores_9_V_ap_vld]
connect_bd_net -net x_0_V_0_1 [get_bd_ports x_0_V] [get_bd_pins hls_inst/x_0_V]
connect_bd_net -net x_1_V_0_1 [get_bd_ports x_1_V] [get_bd_pins hls_inst/x_1_V]
connect_bd_net -net x_2_V_0_1 [get_bd_ports x_2_V] [get_bd_pins hls_inst/x_2_V]
connect_bd_net -net x_3_V_0_1 [get_bd_ports x_3_V] [get_bd_pins hls_inst/x_3_V]
connect_bd_net -net x_4_V_0_1 [get_bd_ports x_4_V] [get_bd_pins hls_inst/x_4_V]
connect_bd_net -net x_5_V_0_1 [get_bd_ports x_5_V] [get_bd_pins hls_inst/x_5_V]
connect_bd_net -net x_6_V_0_1 [get_bd_ports x_6_V] [get_bd_pins hls_inst/x_6_V]

validate_bd_design
save_bd_design
